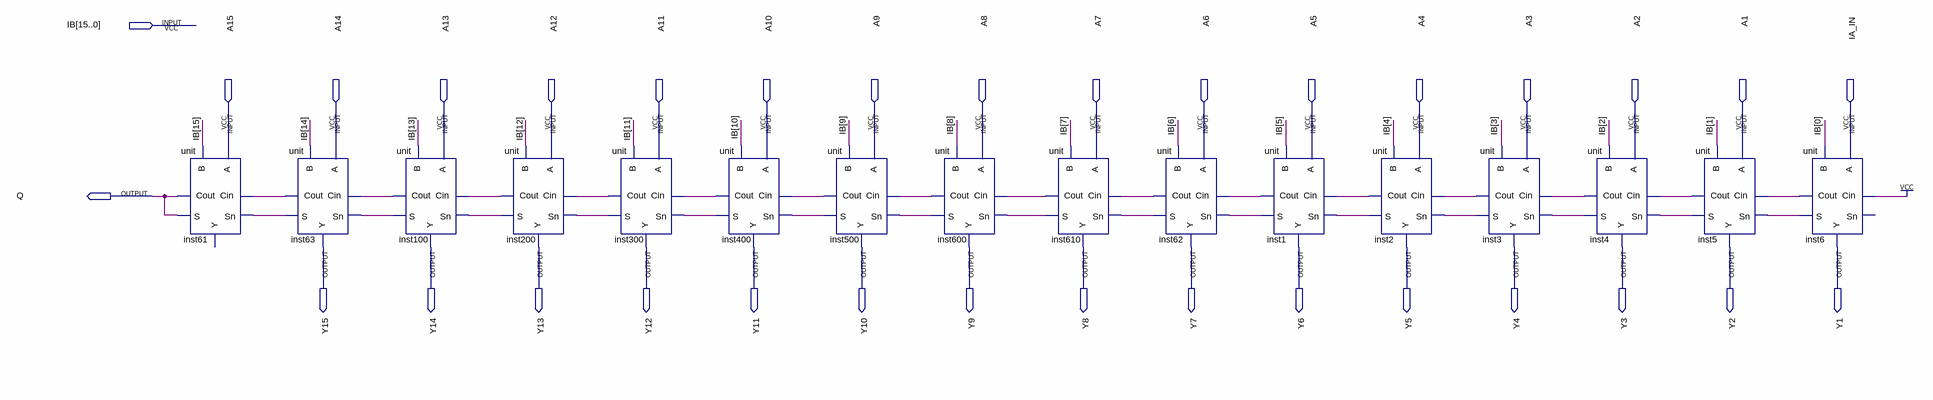
[diagram p0: schematic sheet]
// Quartus schematic division1x16b.bdf as structural Verilog: 16 symbols, 33 pins
module division1x16b (
  input  [15:0] IB,
  input  A15,
  input  A14,
  input  A13,
  input  A12,
  input  A11,
  input  A10,
  input  A9,
  input  A8,
  input  A7,
  input  A6,
  input  A5,
  input  A4,
  input  A3,
  input  A2,
  input  A1,
  input  IA_IN,
  output Q,
  output Y15,
  output Y14,
  output Y13,
  output Y12,
  output Y11,
  output Y10,
  output Y9,
  output Y8,
  output Y7,
  output Y6,
  output Y5,
  output Y4,
  output Y3,
  output Y2,
  output Y1
);

  wire inst1_cout, inst1_sn, inst2_cout, inst2_sn, inst3_cout, inst3_sn, inst4_cout, inst4_sn, inst5_cout,
       inst5_sn, inst6_cout, inst61_sn, inst62_cout, inst62_sn, inst63_cout, inst63_sn, inst100_cout,
       inst100_sn, inst200_cout, inst200_sn, inst300_cout, inst300_sn, inst400_cout, inst400_sn,
       inst500_cout, inst500_sn, inst600_cout, inst600_sn, inst610_cout, inst610_sn;

  unit inst61 (.B(IB[15]), .A(A15), .Cin(inst63_cout), .S(Q), .Cout(Q), .Sn(inst61_sn));  // open: Y
  unit inst63 (.B(IB[14]), .A(A14), .Cin(inst100_cout), .S(inst61_sn), .Cout(inst63_cout), .Y(Y15), .Sn(inst63_sn));
  unit inst100 (.B(IB[13]), .A(A13), .Cin(inst200_cout), .S(inst63_sn), .Cout(inst100_cout), .Y(Y14), .Sn(inst100_sn));
  unit inst200 (.B(IB[12]), .A(A12), .Cin(inst300_cout), .S(inst100_sn), .Cout(inst200_cout), .Y(Y13), .Sn(inst200_sn));
  unit inst300 (.B(IB[11]), .A(A11), .Cin(inst400_cout), .S(inst200_sn), .Cout(inst300_cout), .Y(Y12), .Sn(inst300_sn));
  unit inst400 (.B(IB[10]), .A(A10), .Cin(inst500_cout), .S(inst300_sn), .Cout(inst400_cout), .Y(Y11), .Sn(inst400_sn));
  unit inst500 (.B(IB[9]), .A(A9), .Cin(inst600_cout), .S(inst400_sn), .Cout(inst500_cout), .Y(Y10), .Sn(inst500_sn));
  unit inst600 (.B(IB[8]), .A(A8), .Cin(inst610_cout), .S(inst500_sn), .Cout(inst600_cout), .Y(Y9), .Sn(inst600_sn));
  unit inst610 (.B(IB[7]), .A(A7), .Cin(inst62_cout), .S(inst600_sn), .Cout(inst610_cout), .Y(Y8), .Sn(inst610_sn));
  unit inst62 (.B(IB[6]), .A(A6), .Cin(inst1_cout), .S(inst610_sn), .Cout(inst62_cout), .Y(Y7), .Sn(inst62_sn));
  unit inst1 (.B(IB[5]), .A(A5), .Cin(inst2_cout), .S(inst62_sn), .Cout(inst1_cout), .Y(Y6), .Sn(inst1_sn));
  unit inst2 (.B(IB[4]), .A(A4), .Cin(inst3_cout), .S(inst1_sn), .Cout(inst2_cout), .Y(Y5), .Sn(inst2_sn));
  unit inst3 (.B(IB[3]), .A(A3), .Cin(inst4_cout), .S(inst2_sn), .Cout(inst3_cout), .Y(Y4), .Sn(inst3_sn));
  unit inst4 (.B(IB[2]), .A(A2), .Cin(inst5_cout), .S(inst3_sn), .Cout(inst4_cout), .Y(Y3), .Sn(inst4_sn));
  unit inst5 (.B(IB[1]), .A(A1), .Cin(inst6_cout), .S(inst4_sn), .Cout(inst5_cout), .Y(Y2), .Sn(inst5_sn));
  unit inst6 (.B(IB[0]), .A(IA_IN), .Cin(1'b1), .S(inst5_sn), .Cout(inst6_cout), .Y(Y1));  // open: Sn
endmodule
